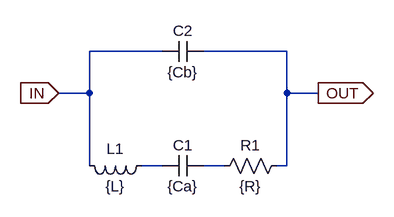
[diagram p0: schematic resonator.asc]
resonator.asc, the LTspice schematic file:
Version 4
SHEET 1 880 680
WIRE 160 96 48 96
WIRE 352 96 224 96
WIRE 48 160 48 96
WIRE 48 160 0 160
WIRE 352 160 352 96
WIRE 400 160 352 160
WIRE 48 272 48 160
WIRE 160 272 128 272
WIRE 256 272 224 272
WIRE 352 272 352 160
WIRE 352 272 336 272
FLAG 0 160 IN
IOPIN 0 160 In
FLAG 400 160 OUT
IOPIN 400 160 Out
SYMBOL ind 144 256 R90
WINDOW 0 5 56 VBottom 2
WINDOW 3 32 56 VTop 2
SYMATTR InstName L1
SYMATTR Value {L}
SYMBOL cap 160 288 R270
WINDOW 0 32 32 VTop 2
WINDOW 3 0 32 VBottom 2
SYMATTR InstName C1
SYMATTR Value {Ca}
SYMBOL res 352 256 R90
WINDOW 0 0 56 VBottom 2
WINDOW 3 32 56 VTop 2
SYMATTR InstName R1
SYMATTR Value {R}
SYMBOL cap 160 112 R270
WINDOW 0 32 32 VTop 2
WINDOW 3 0 32 VBottom 2
SYMATTR InstName C2
SYMATTR Value {Cb}

The netlist it stands for:
* resonator.asc
L1 N001 IN {L}
C1 N001 N002 {Ca}
R1 OUT N002 {R}
C2 IN OUT {Cb}
.backanno
.end